# Altium schematic sheet 13-MT7688AN Peripheral-C.SchDoc
size 558 x 457 mm
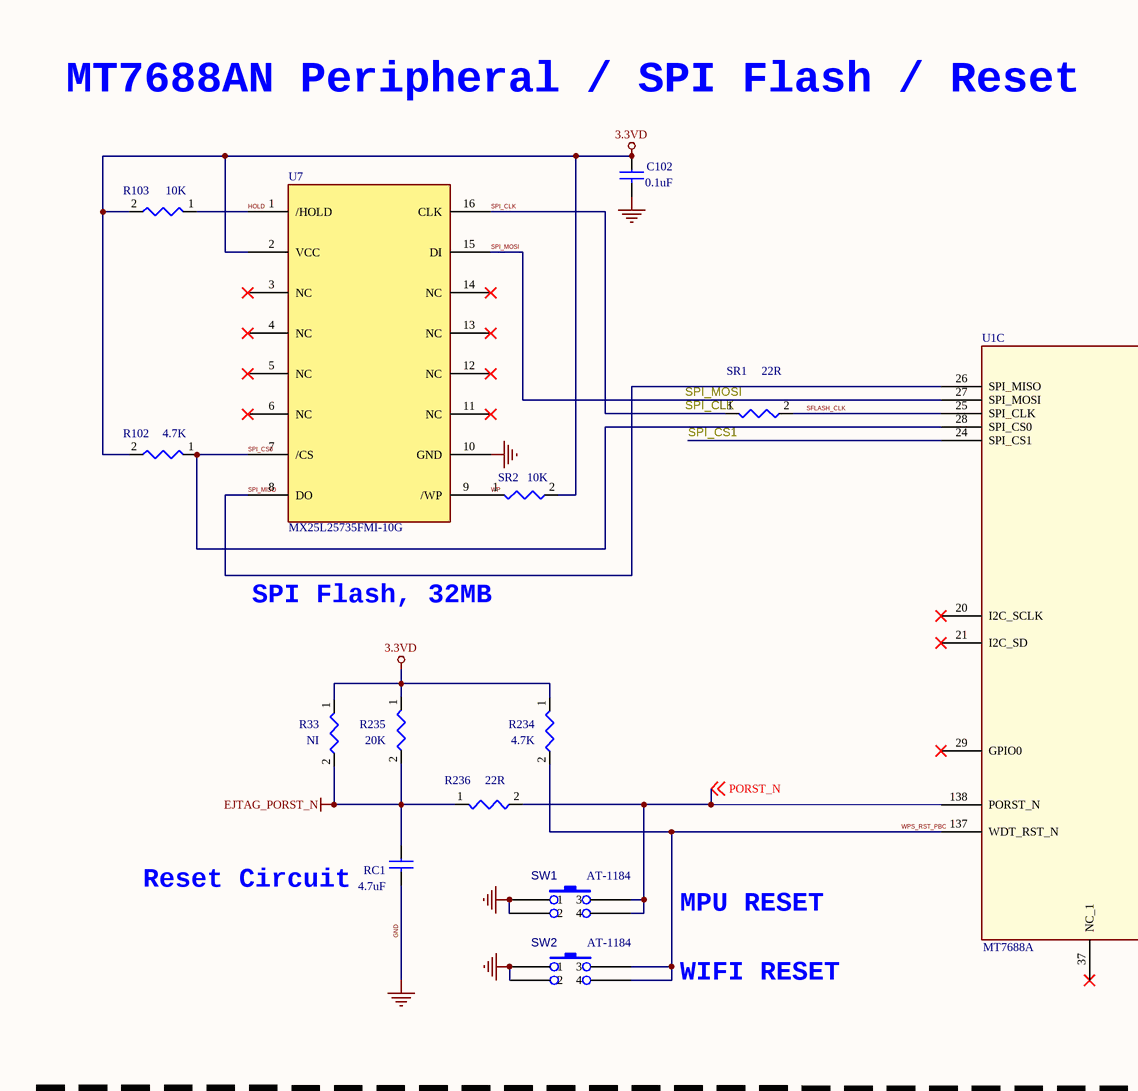
[diagram p0: 13-MT7688AN Peripheral-C.SchDoc, top left]
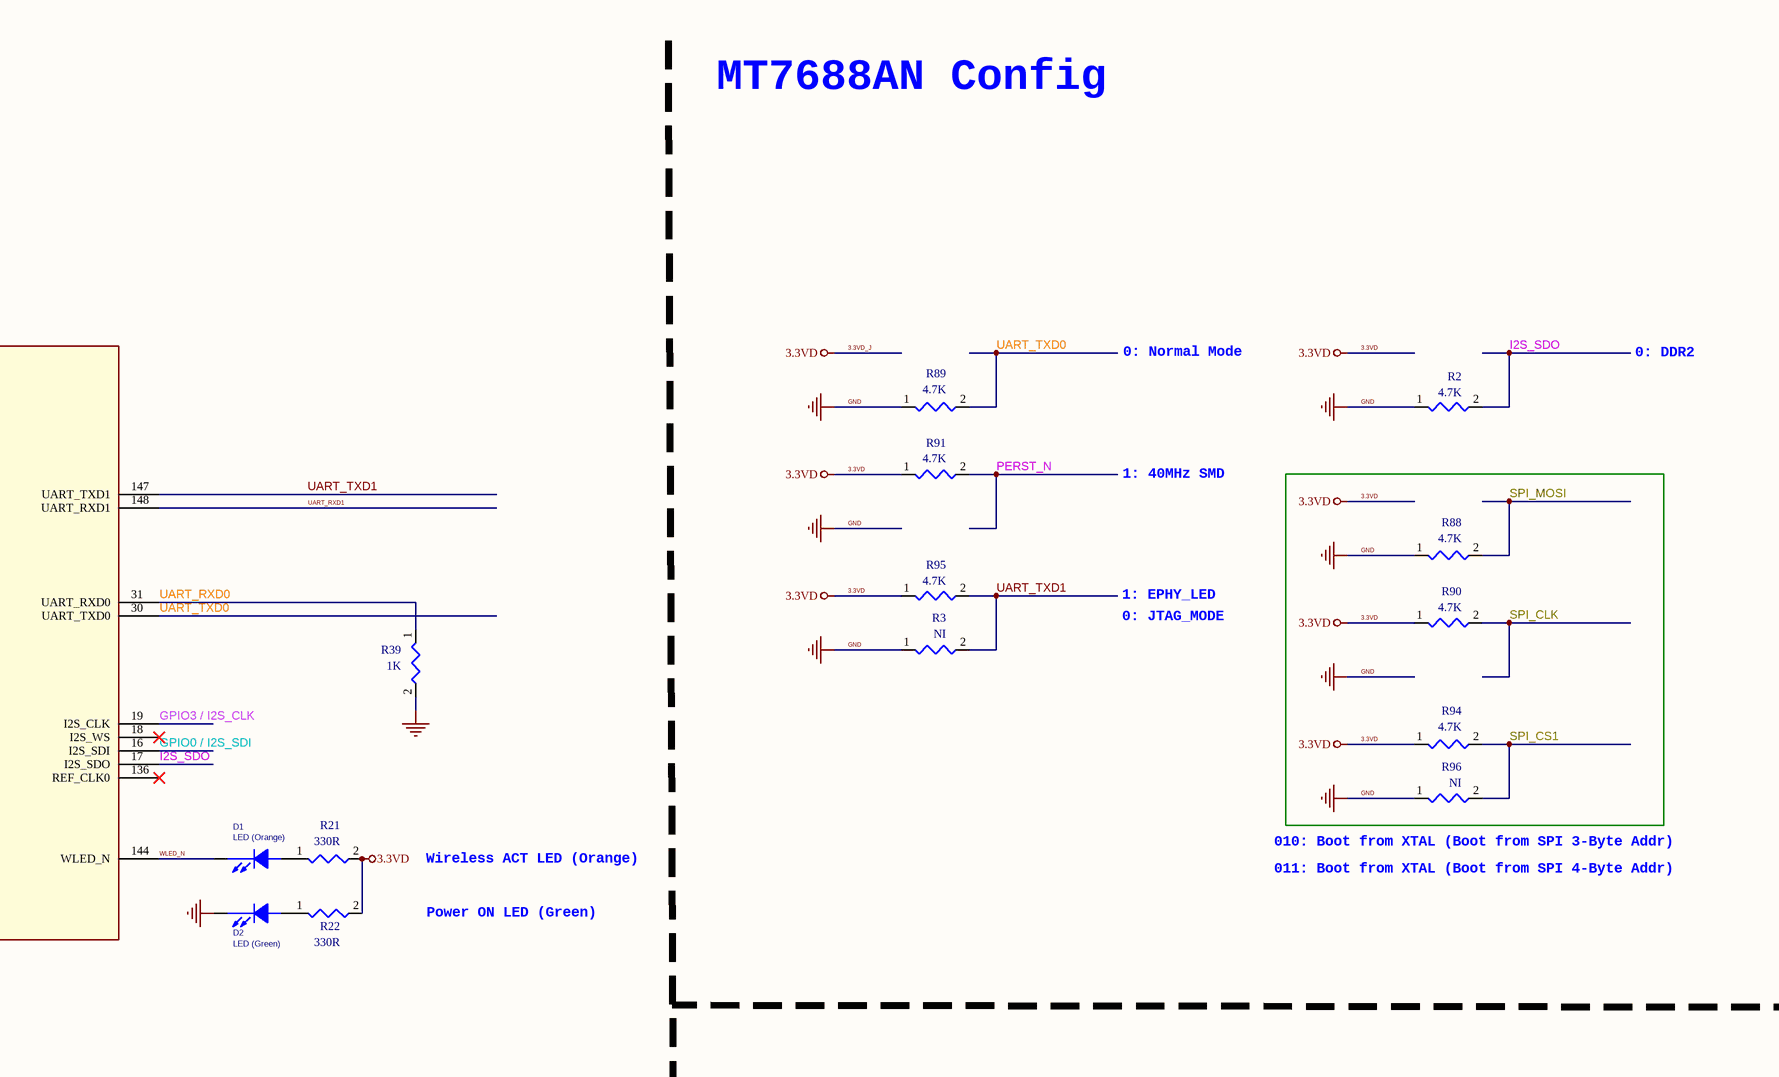
[diagram p1: 13-MT7688AN Peripheral-C.SchDoc, top right]
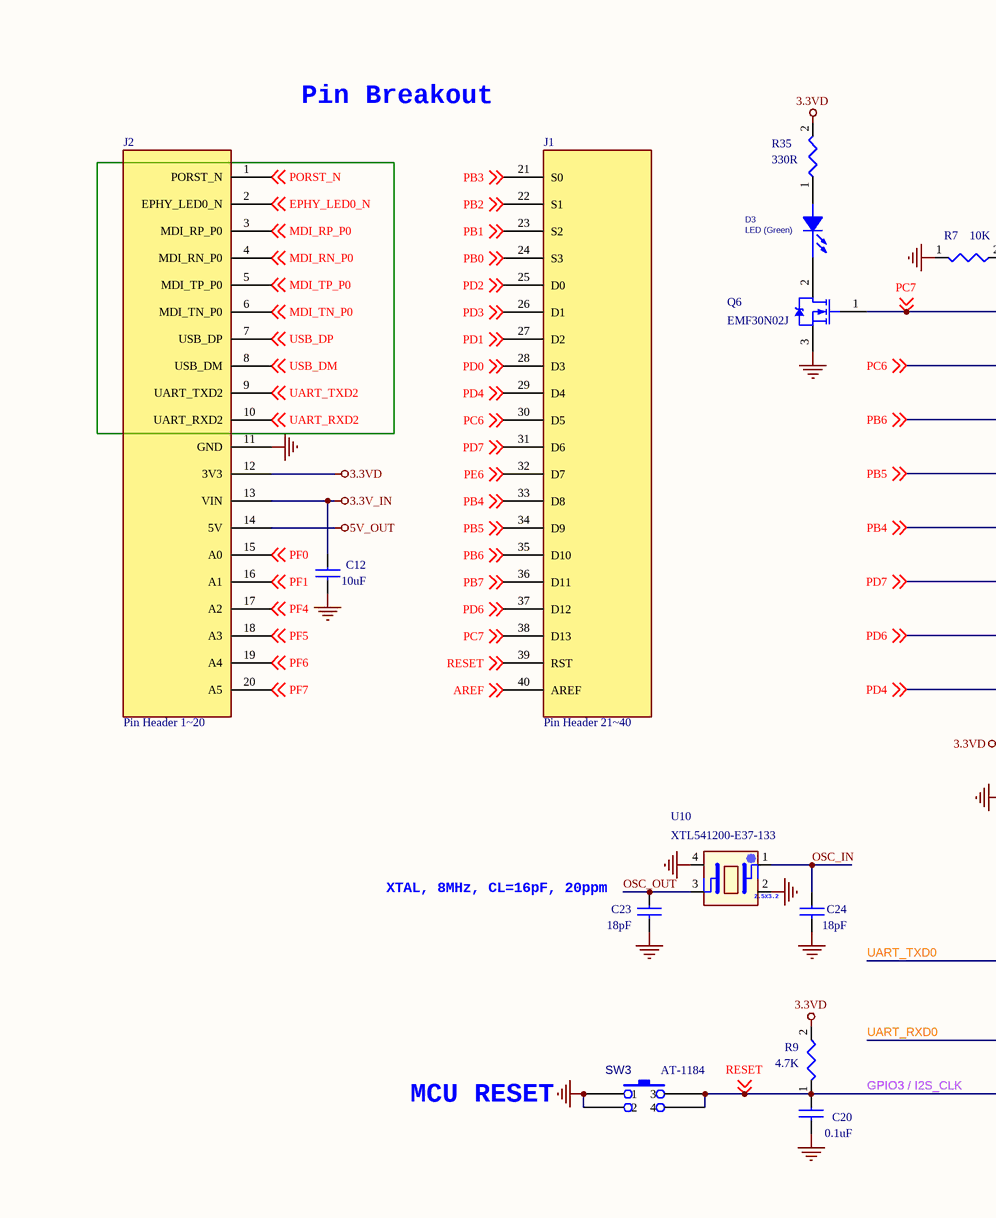
[diagram p2: 13-MT7688AN Peripheral-C.SchDoc, bottom left]
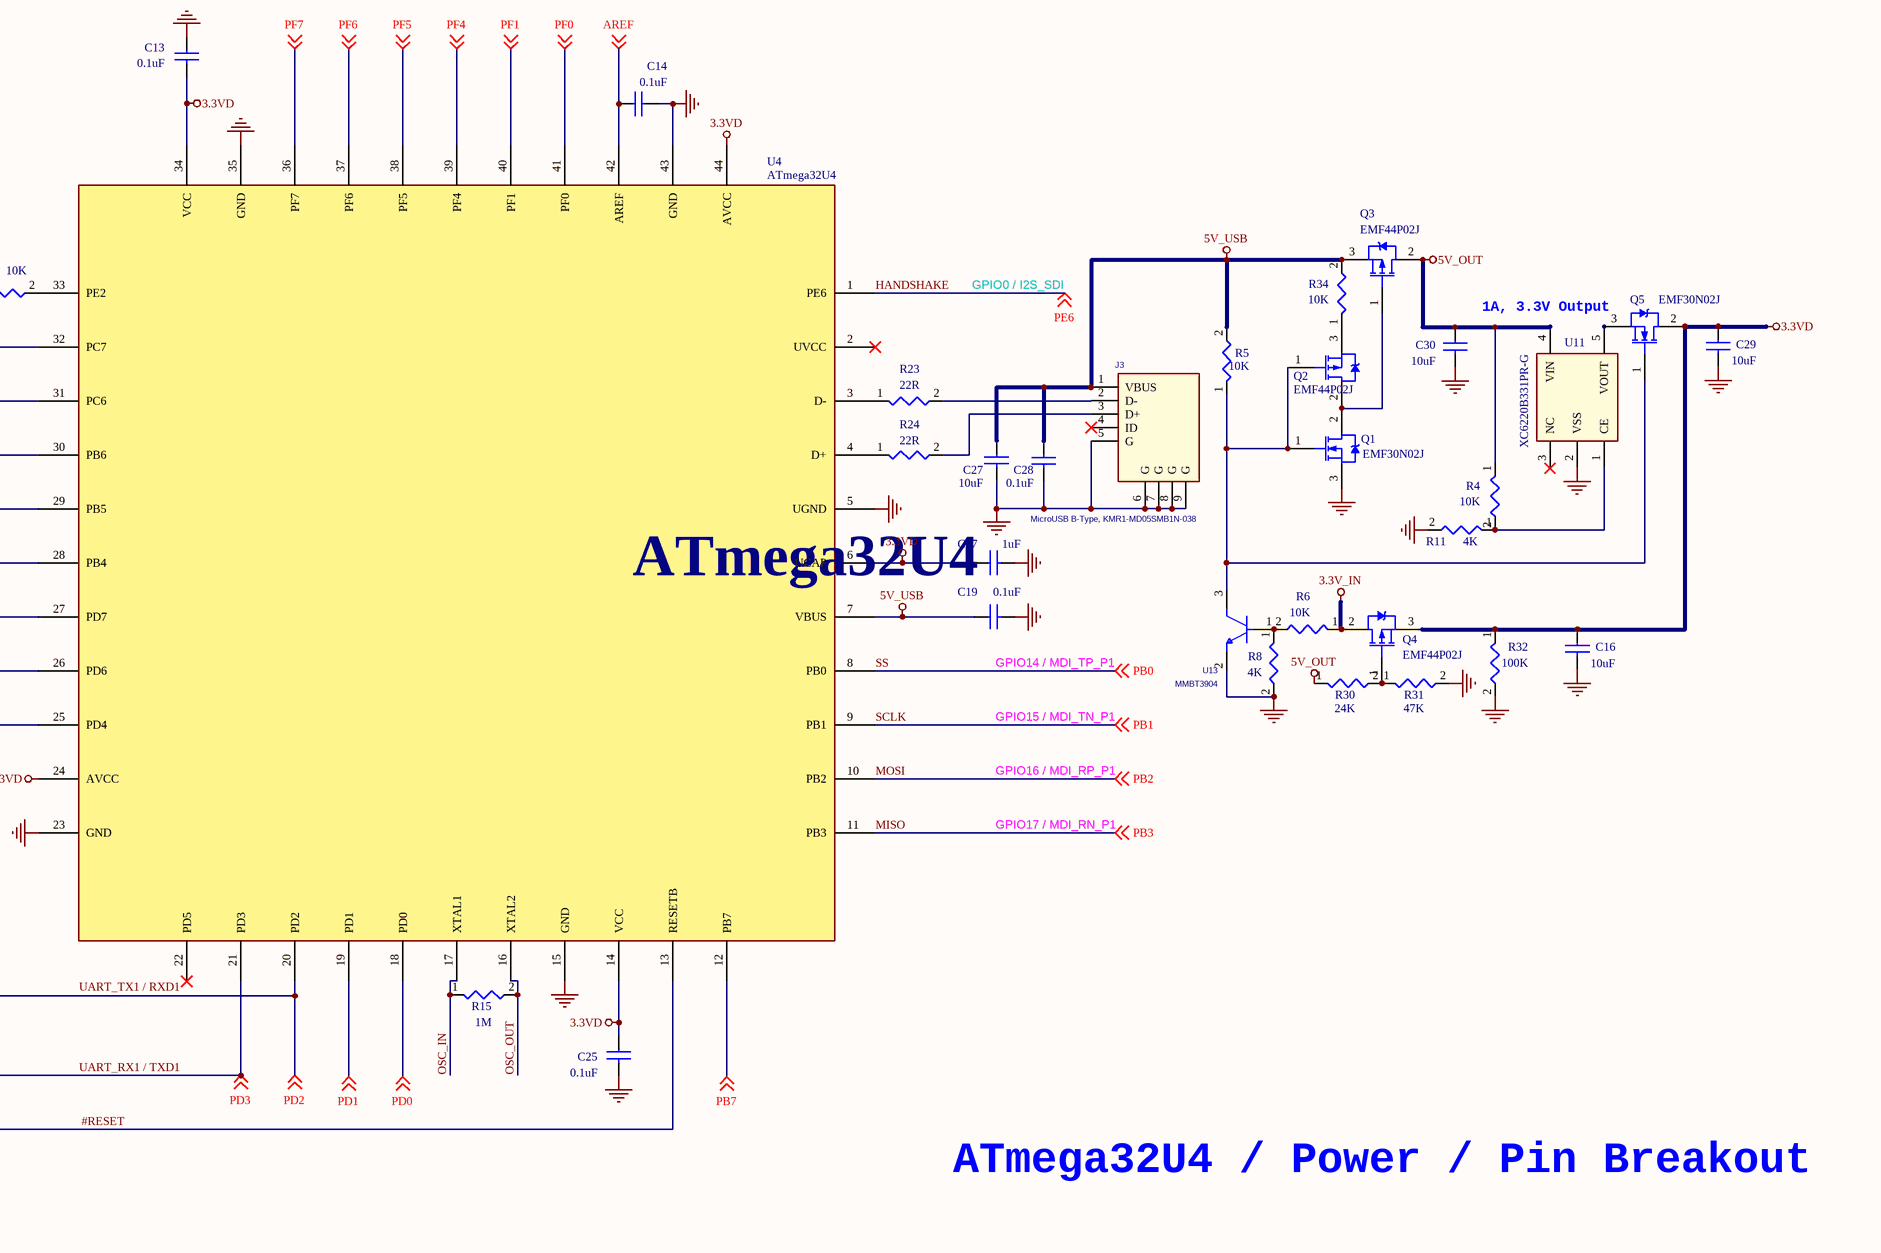
[diagram p3: 13-MT7688AN Peripheral-C.SchDoc, bottom right]

## Parts
C12  10uF  [RLC 0402 M35]
C13  0.1uF  [RLC 0201 M35]
C14  0.1uF  [RLC 0201 M35]
C16  10uF  [RLC 0402 M35]
C17  1uF  [RLC 0201 M35]
C19  0.1uF  [RLC 0201 M35]
C20  0.1uF  [RLC 0201 M35]
C23  18pF  [RLC 0201 M35]
C24  18pF  [RLC 0201 M35]
C25  0.1uF  [RLC 0201 M35]
C27  10uF  [RLC 0402 M35]
C28  0.1uF  [RLC 0201 M35]
C29  10uF  [RLC 0402 M35]
C30  10uF  [RLC 0402 M35]
C102  0.1uF  [RLC 0201 M35]
D1  LED (Orange)  [LED 0603]
D2  LED (Green)  [LED 0603]
D3  LED (Green)  [LED 0603]
J1  Pin Header 21~40  [Pin Header 21 ~ 40]
J2  Pin Header 1~20  [Pin Header 1~20]
J3  MicroUSB B-Type, KMR1-MD05SMB1N-038  [MicroUSB-B]
Q1  EMF30N02J  [SOT-23 - MOS]
Q2  EMF44P02J  [SOT-23 - MOS]
Q3  EMF44P02J  [SOT-23 - MOS]
Q4  EMF44P02J  [SOT-23 - MOS]
Q5  EMF30N02J  [SOT-23 - MOS]
Q6  EMF30N02J  [SOT-23 - MOS]
R2  4.7K  [RLC 0201 M35]
R3  NI  [RLC 0402 M35]
R4  10K  [RLC 0201 M35]
R5  10K  [RLC 0201 M35]
R6  10K  [RLC 0201 M35]
R7  10K  [RLC 0201 M35]
R8  4K  [RLC 0201 M35]
R9  4.7K  [RLC 0201 M35]
R11  4K  [RLC 0201 M35]
R15  1M  [RLC 0201 M35]
R21  330R  [RLC 0201 M35]
R22  330R  [RLC 0201 M35]
R23  22R  [RLC 0201 M35]
R24  22R  [RLC 0201 M35]
R30  24K  [RLC 0201 M35]
R31  47K  [RLC 0201 M35]
R32  100K  [RLC 0201 M35]
R33  NI  [RLC 0201 M35]
R34  10K  [RLC 0201 M35]
R35  330R  [RLC 0201 M35]
R39  1K  [RLC 0201 M35]
R88  4.7K  [RLC 0201 M35]
R89  4.7K  [RLC 0201 M35]
R90  4.7K  [RLC 0201 M35]
R91  4.7K  [RLC 0201 M35]
R94  4.7K  [RLC 0201 M35]
R95  4.7K  [RLC 0402 M35]
R96  NI  [RLC 0201 M35]
R102  4.7K  [RLC 0201 M35]
R103  10K  [RLC 0201 M35]
R234  4.7K  [RLC 0201 M35]
R235  20K  [RLC 0201 M35]
R236  22R  [RLC 0201 M35]
RC1  4.7uF  [RLC 0402 M35]
SR1  22R  [RLC 0201 M35]
SR2  10K  [RLC 0201 M35]
SW1  AT-1184  [AT-1184]
SW2  AT-1184  [AT-1184]
SW3  AT-1184  [AT-1184]
U1  MT7688A  [MT7628AN$2F$DRQFN156$2F$SMD$2F$P0.5$2F$12X12]  (part C of 6)
U4  ATmega32U4  [ATmega32U4-MU]
U7  MX25L25735FMI-10G  [SOP-16]
U10  XTL541200-E37-133  [XTAL 5032]
U11  XC6220B331PR-G  [SOT-89-5]
U13  MMBT3904  [SOT-23 - BJT]

## Nets
3.3V_IN: C12.1 J2.13(VIN) Q4.2(D) R6.1
3.3VD: C13.2 C16.1 C17.1 C25.1 C29.1 C102.1 J2.12(3V3) Q4.3(S) Q5.2(D) R9.2 R21.2 R22.2 R32.1 R33.1 R35.2 R90.1 R91.1 R94.1 R95.1 R102.2 R103.2 R234.1 R235.1 SR2.2 U4.6(UCAP) U4.14(VCC) U4.24(AVCC) U4.34(VCC) U4.44(AVCC) U7.2(VCC)  [also labelled 3.3VD_J]
5V_OUT: C30.1 J2.14(5V) Q3.2(D) R4.1 R30.1 U11.4(VIN)
5V_USB: C19.1 C27.1 C28.1 J3.1(VBUS) Q3.3(S) R5.2 R34.2 U4.7(VBUS)
EJTAG_PORST_N: R33.2 R235.2 R236.1 RC1.1
GND: C12.2 C13.1 C14.2 C16.2 C17.2 C19.2 C20.2 C23.2 C24.2 C25.2 C27.2 C28.2 C29.2 C30.2 C102.2 D2.2(CATHODE) J2.11(GND) J3.5(G) J3.6(G) J3.7(G) J3.8(G) J3.9(G) Q1.3(S) Q6.3(S) R2.1 R3.1 R7.1 R8.2 R11.2 R31.2 R32.2 R39.2 R88.1 R89.1 R96.1 RC1.2 SW1.1 SW1.2 SW2.1 SW2.2 SW3.1 SW3.2 U4.5(UGND) U4.15(GND) U4.23(GND) U4.35(GND) U4.43(GND) U7.10(GND) U10.2(NC) U10.4(NC) U11.2(VSS) U13.2(E)
#RESET: C20.1 J1.39(RST) R9.1 SW3.3 SW3.4 U1.19(I2S_CLK) U4.13(RESETB) ; off-sheet RESET  [also labelled GPIO3 / I2S_CLK, RESET]
AREF: C14.1 J1.40(AREF) U4.42(AREF) ; off-sheet AREF
EPHY_LED0_N: J2.2(EPHY_LED0_N) ; off-sheet EPHY_LED0_N
GPIO0 / I2S_SDI: J1.32(D7) U1.16(I2S_SDI) U4.1(PE6) ; off-sheet PE6  [also labelled HANDSHAKE, PE6]
GPIO14 / MDI_TP_P1: J1.24(S3) U4.8(PB0) ; off-sheet PB0  [also labelled PB0, SS]
GPIO15 / MDI_TN_P1: J1.23(S2) U4.9(PB1) ; off-sheet PB1  [also labelled PB1, SCLK]
GPIO16 / MDI_RP_P1: J1.22(S1) U4.10(PB2) ; off-sheet PB2  [also labelled MOSI, PB2]
GPIO17 / MDI_RN_P1: J1.21(S0) U4.11(PB3) ; off-sheet PB3  [also labelled MISO, PB3]
HOLD: R103.1 U7.1(/HOLD)
I2S_SDO: R2.2 U1.17(I2S_SDO)
MDI_RN_P0: J2.4(MDI_RN_P0) ; off-sheet MDI_RN_P0
MDI_RP_P0: J2.3(MDI_RP_P0) ; off-sheet MDI_RP_P0
MDI_TN_P0: J2.6(MDI_TN_P0) ; off-sheet MDI_TN_P0
MDI_TP_P0: J2.5(MDI_TP_P0) ; off-sheet MDI_TP_P0
OSC_IN: C24.1 R15.1 U4.17(XTAL1) U10.1(X1)
OSC_OUT: C23.1 R15.2 U4.16(XTAL2) U10.3(X2)
PB4: J1.33(D8) U4.28(PB4) ; off-sheet PB4
PB5: J1.34(D9) U4.29(PB5) ; off-sheet PB5
PB6: J1.35(D10) U4.30(PB6) ; off-sheet PB6
PB7: J1.36(D11) U4.12(PB7) ; off-sheet PB7
PC6: J1.30(D5) U4.31(PC6) ; off-sheet PC6
PC7: J1.38(D13) Q6.1(G) U4.32(PC7) ; off-sheet PC7
PD0: J1.28(D3) U4.18(PD0) ; off-sheet PD0
PD1: J1.27(D2) U4.19(PD1) ; off-sheet PD1
PD4: J1.29(D4) U4.25(PD4) ; off-sheet PD4
PD6: J1.37(D12) U4.26(PD6) ; off-sheet PD6
PD7: J1.31(D6) U4.27(PD7) ; off-sheet PD7
PERST_N: R91.2
PF0: J2.15(A0) U4.41(PF0) ; off-sheet PF0
PF1: J2.16(A1) U4.40(PF1) ; off-sheet PF1
PF4: J2.17(A2) U4.39(PF4) ; off-sheet PF4
PF5: J2.18(A3) U4.38(PF5) ; off-sheet PF5
PF6: J2.19(A4) U4.37(PF6) ; off-sheet PF6
PF7: J2.20(A5) U4.36(PF7) ; off-sheet PF7
PORST_N: J2.1(PORST_N) R236.2 SW1.3 SW1.4 U1.138(PORST_N) ; off-sheet PORST_N
SFLASH_CLK: SR1.2 U1.25(SPI_CLK)
SPI_CLK: R90.2 SR1.1 U7.16(CLK)
SPI_CS0: R102.1 U1.28(SPI_CS0) U7.7(/CS)
SPI_CS1: R94.2 R96.2 U1.24(SPI_CS1)
SPI_MISO: U1.26(SPI_MISO) U7.8(DO)
SPI_MOSI: R88.2 U1.27(SPI_MOSI) U7.15(DI)
UART_RX1 / TXD1: J1.26(D1) R39.1 U1.31(UART_RXD0) U4.21(PD3) ; off-sheet PD3  [also labelled PD3, UART_RXD0]
UART_RXD1: U1.148(UART_RXD1)
UART_RXD2: J2.10(UART_RXD2) ; off-sheet UART_RXD2
UART_TXD0: J1.25(D0) R89.2 U1.30(UART_TXD0) U4.20(PD2) ; off-sheet PD2  [also labelled PD2]
UART_TXD1: R3.2 R95.2 U1.147(UART_TXD1)
UART_TXD2: J2.9(UART_TXD2) ; off-sheet UART_TXD2
USB_DM: J2.8(USB_DM) ; off-sheet USB_DM
USB_DP: J2.7(USB_DP) ; off-sheet USB_DP
WLED_N: D1.2(CATHODE) U1.144(WLED_N)
WP: SR2.1 U7.9(/WP)
WPS_RST_PBC: R234.2 SW2.3 SW2.4 U1.137(WDT_RST_N)
NetD1_1: D1.1(ANODE) R21.1
NetD2_1: D2.1(ANODE) R22.1
NetD3_1: D3.1(ANODE) R35.1
NetD3_2: D3.2(CATHODE) Q6.2(D)
NetJ3_2: J3.2(D-) R23.2
NetJ3_3: J3.3(D+) R24.2
NetQ1_1: Q1.1(G) Q2.1(G) Q5.1(G) R5.1 U13.3(C)
NetQ1_2: Q1.2(D) Q2.2(D) Q3.1(G)
NetQ2_3: Q2.3(S) R34.1
NetQ4_1: Q4.1(G) R30.2 R31.1
NetQ5_3: Q5.3(S) U11.5(VOUT)
NetR4_2: R4.2 R11.1 U11.1(CE)
NetR6_2: R6.2 R8.1 U13.1(B)
NetR7_2: R7.2 U4.33(PE2)
NetR23_1: R23.1 U4.3(D-)
NetR24_1: R24.1 U4.4(D+)

Not connected (* = marked no-connect by the designer): J3 4(ID)*; U1 18(I2S_WS)* 20(I2C_SCLK)* 21(I2C_SD)* 29(GPIO0)* 37(NC_1)* 136(REF_CLK0)*; U4 2(UVCC)* 22(PD5)*; U7 3(NC)* 4(NC)* 5(NC)* 6(NC)* 11(NC)* 12(NC)* 13(NC)* 14(NC)*; U11 3(NC)*

## Notes on the sheet
- MT7688AN Peripheral / SPI Flash / Reset
- MT7688AN Config
- 0: Normal Mode
- 0: DDR2
- 1: 40MHz SMD
- SPI Flash, 32MB
- 1: EPHY_LED
- 0: JTAG_MODE
- (near R96) 010: Boot from XTAL (Boot from SPI 3-Byte Addr)
- Reset Circuit
- MPU RESET
- Wireless ACT LED (Orange)
- 011: Boot from XTAL (Boot from SPI 4-Byte Addr)
- Power ON LED (Green)
- WIFI RESET
- Pin Breakout
- 1A, 3.3V Output
- XTAL, 8MHz, CL=16pF, 20ppm
- MCU RESET
- ATmega32U4 / Power / Pin Breakout
- Labels drawn without touching a wire or pin: UART_TX1 / RXD1
- (in symbol XTAL_3.2x2.5) 2.5x3.2

## Library data of the parts
C12-C14 C16 C17 C19 C20 C23-C25 C27-C30 C102 RC1 = CAP NP
D1-D3 = LED
J1 = Pin Header 21~40: Pin Header Pitch 2.54mm
J2 = Pin Header 1~20: Pin Header Pitch 2.54mm
J3 = Micro USB TYPE-B: MicroUSB B-Type; Manufacturer P/N: PJ-002BH-SMT; Manufacturer: CUI Inc.; Distributor: Digikey; Distributor P/N: CP-002BHPJTR-ND
Q1 Q5 Q6 = NMOS-2: N-Channel Power MOSFET; Note: Pin 2 is electrically connected to pin 4.; Published: 8-Jun-2000; LatestRevisionDate: 17-Jul-2002; LatestRevisionNote: Re-released for DXP Platform.; DatasheetVersion: PD-9.814; PackageVersion: Feb-1997; PackageReference: TO-220AB; Publisher: Altium Limited; PackageDescription: TO, Thru-Hole, Vertical, Heatsink Mounted; 3 In-Line Leads; Pitch 2.54 mm; ComponentLink1Description: Manufacturer Link; ComponentLink1URL: http://www.irf.com/
Q2-Q4 = PMOS-2: P-Channel Power MOSFET; Note: Pin 4 not drawn and electrically connected to Pin 2.; Published: 8-Jun-2000; LatestRevisionDate: 17-Jul-2002; LatestRevisionNote: Re-released for DXP Platform.; DatasheetVersion: PD-9.390D; PackageVersion: Feb-1997; PackageReference: TO-220AB; Publisher: Altium Limited; PackageDescription: TO, Thru-Hole, Vertical, Heatsink Mounted; 3 In-Line Leads; Pitch 2.54 mm; ComponentLink1Description: Manufacturer Link; ComponentLink1URL: http://www.irf.com/
R2-R9 R11 R15 R21-R24 R30-R35 R39 R88-R91 R94-R96 R102 R103 R234-R236 SR1 SR2 = RES/0402_3
SW1-SW3 = SW: TACT Switch, H=1.5mm; Manufacturer: Panasonic - ECG; Manufacturer P/N: EVQ-Q2B01W; Distributor P/N: P12930SCT-ND; Distributor: Digikey
U1 = MT7620N-n_26
U4 = ATmega32U4: 44-Pin, QFN, 7x7mm
U7 = SPIFlash-MXIC: SPI Flash 32MB, SOP-16, H=2.65mm
U10 = XTAL_3.2x2.5: XTAL, 8MHz, CL=16pF, 20ppm
U11 = XC6220B421PR-G: 1A, 3.3V LDO, SOT-89-5
U13 = MMBT3904: NPN BJT, SOT-23